# EAGLE design mapleCUx_large_226 (EAGLE 7.3.0)
MAPLE-CUx Large Version
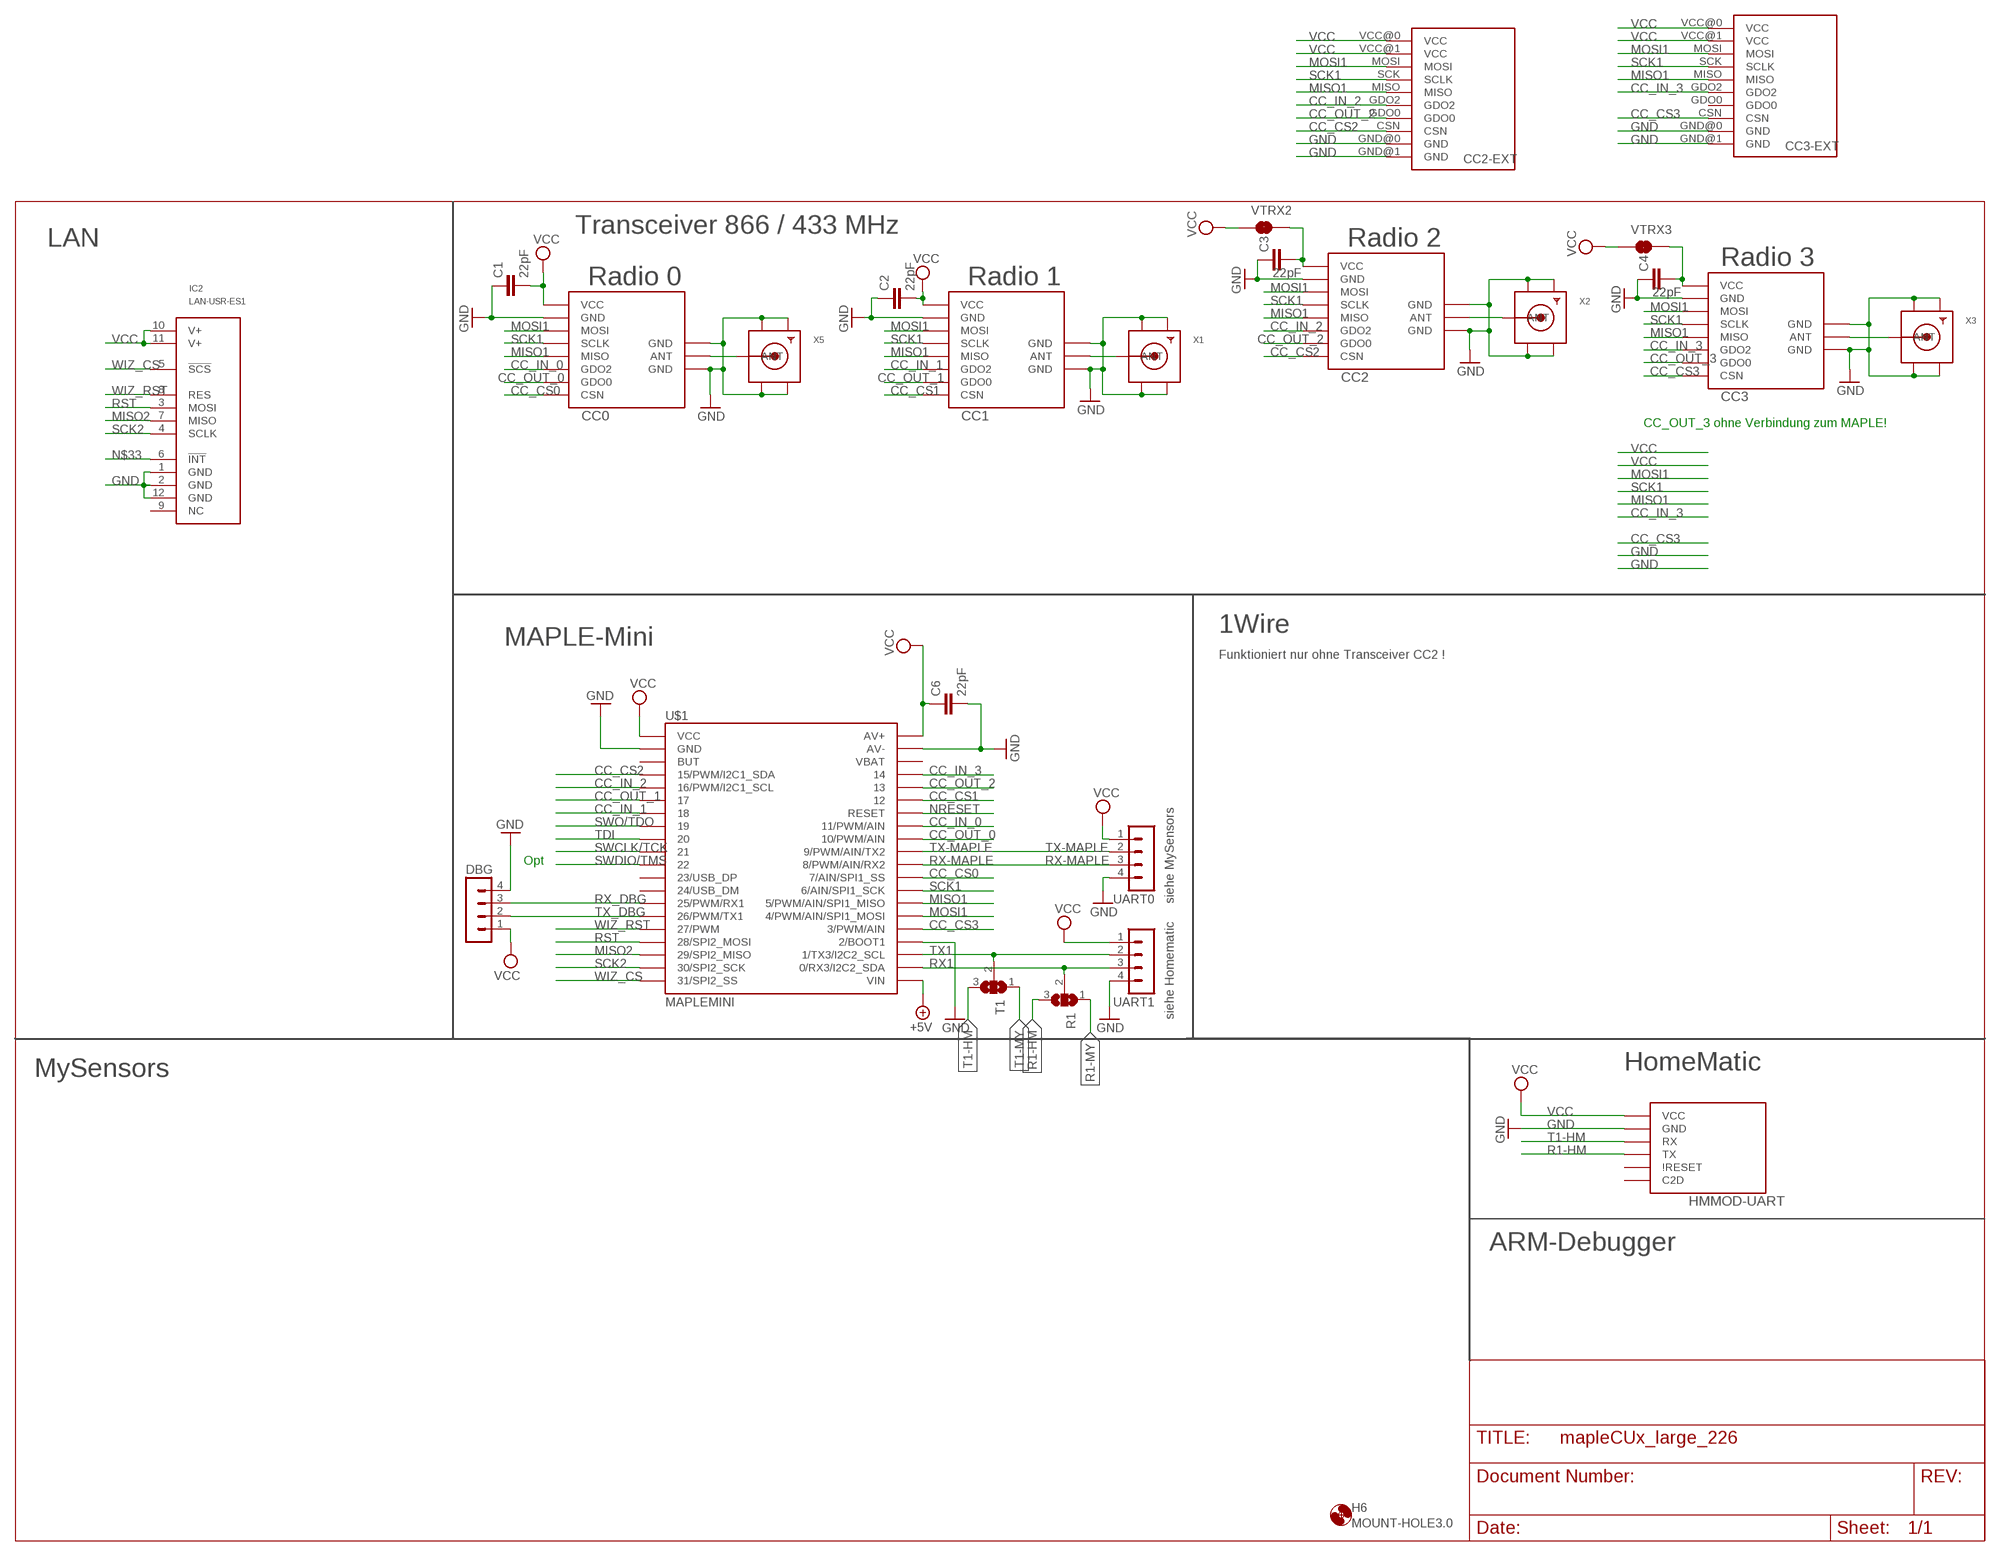
[diagram p0: schematic, sheet 1]

## Parts
C1  22pF  C-EUC0805  [C0805]
C2  22pF  C-EUC0805  [C0805]
C3  22pF  C-EUC0805  [C0805]
C4  22pF  C-EUC0805  [C0805]
C6  22pF  C-EUC0805  [C0805]
CC0  CC1101  CC1101_MODULE1SMD  [CC1101_MODULE1_SMD]
CC1  CC1101_MODULE1SMD  [CC1101_MODULE1_SMD]
CC2  CC1101_MODULE1SMD  [CC1101_MODULE1_SMD]
CC2-EXT  CC1101_MODULE3_DIL  [CC1101_MODULE3_DIL]
CC3  CC1101_MODULE1SMD  [CC1101_MODULE1_SMD]
CC3-EXT  CC1101_MODULE3_DIL  [CC1101_MODULE3_DIL]
DBG  MA04-1  [MA04-1]
H6  MOUNT-HOLE3.0  [3,0]
HMMOD-UART  HM-MOD-UARTDIL  [HM-MOD-UART-DIL]
IC2  LAN-USR-ES1  [USR-ES1]
R1  SJ2W  [SJ_2]
T1  SJ2W  [SJ_2]
U$1  MAPLEMINI  [20-DIP]
UART0  MA04-1  [MA04-1]
UART1  MA04-1  [MA04-1]
VTRX2  JUMPER-SMT_2_NC_TRACE_SILK  [SMT-JUMPER_2_NC_TRACE_SILK]
VTRX3  JUMPER-SMT_2_NC_TRACE_SILK  [SMT-JUMPER_2_NC_TRACE_SILK]
X1  SMACONNECTOR_EDGE  [SMA_EDGELAUNCH]
X2  SMACONNECTOR_EDGE  [SMA_EDGELAUNCH]
X3  SMACONNECTOR_EDGE  [SMA_EDGELAUNCH]
X5  SMACONNECTOR_EDGE  [SMA_EDGELAUNCH]

## Nets
+5V [PWR]: U$1.21(VIN)
ANT0: CC0.ANT X5.P(ANT)
ANT1: CC1.ANT X1.P(ANT)
ANT2: CC2.ANT X2.P(ANT)
ANT3: CC3.ANT X3.P(ANT)
CC_CS0: CC0.CSN U$1.29(7/AIN/SPI1_SS)
CC_CS1: CC1.CSN U$1.35
CC_CS2: CC2-EXT.CSN CC2.CSN U$1.4(15/PWM/I2C1_SDA)
CC_CS3: CC3-EXT.CSN CC3.CSN U$1.25(3/PWM/AIN)
CC_IN_0: CC0.GDO2 U$1.33(11/PWM/AIN)
CC_IN_1: CC1.GDO2 U$1.7
CC_IN_2: CC2-EXT.GDO2 CC2.GDO2 U$1.5(16/PWM/I2C1_SCL)
CC_IN_3: CC3-EXT.GDO2 CC3.GDO2 U$1.37
CC_OUT_0: CC0.GDO0 U$1.32(10/PWM/AIN)
CC_OUT_1: CC1.GDO0 U$1.6
CC_OUT_2: CC2-EXT.GDO0 CC2.GDO0 U$1.36
CC_OUT_3: CC3.GDO0
GND [PWR]: C1.1 C2.1 C3.1 C4.1 C6.2 CC0.GND@0(GND) CC0.GND@1(GND) CC0.GND@2(GND) CC1.GND@0(GND) CC1.GND@1(GND) CC1.GND@2(GND) CC2-EXT.GND@0(GND) CC2-EXT.GND@1(GND) CC2.GND@0(GND) CC2.GND@1(GND) CC2.GND@2(GND) CC3-EXT.GND@0(GND) CC3-EXT.GND@1(GND) CC3.GND@0(GND) CC3.GND@1(GND) CC3.GND@2(GND) DBG.4 HMMOD-UART.2(GND) IC2.1(GND) IC2.2(GND) IC2.12(GND) U$1.2(GND) U$1.24(2/BOOT1) U$1.39(AV-) UART0.4 UART1.4 X1.GND@1(GND4) X1.GND@2(GND3) X1.GND@3(GND2) X1.GND@4(GND1) X2.GND@1(GND4) X2.GND@2(GND3) X2.GND@3(GND2) X2.GND@4(GND1) X3.GND@1(GND4) X3.GND@2(GND3) X3.GND@3(GND2) X3.GND@4(GND1) X5.GND@1(GND4) X5.GND@2(GND3) X5.GND@3(GND2) X5.GND@4(GND1)
MISO1: CC0.MISO CC1.MISO CC2-EXT.MISO CC2.MISO CC3-EXT.MISO CC3.MISO U$1.27(5/PWM/AIN/SPI1_MISO)
MISO2: IC2.7(MISO) U$1.18(29/SPI2_MISO)
MOSI1: CC0.MOSI CC1.MOSI CC2-EXT.MOSI CC2.MOSI CC3-EXT.MOSI CC3.MOSI U$1.26(4/PWM/AIN/SPI1_MOSI)
N$1 [PWR]: C3.2 CC2.VCC VTRX2.2
N$3 [PWR]: C4.2 CC3.VCC VTRX3.2
N$33: IC2.6(!INT!)
NRESET: U$1.34(RESET)
R1-HM: HMMOD-UART.5(TX) R1.3
R1-MY: R1.1
RST: IC2.3(MOSI) U$1.17(28/SPI2_MOSI)
RX1: R1.2 U$1.22(0/RX3/I2C2_SDA) UART1.3
RX-MAPLE: U$1.30(8/PWM/AIN/RX2) UART0.3
RX_DBG: DBG.3 U$1.14(25/PWM/RX1)
SCK1: CC0.SCLK CC1.SCLK CC2-EXT.SCK(SCLK) CC2.SCLK CC3-EXT.SCK(SCLK) CC3.SCLK U$1.28(6/AIN/SPI1_SCK)
SCK2: IC2.4(SCLK) U$1.19(30/SPI2_SCK)
SWCLK/TCK: U$1.10
SWDIO/TMS: U$1.11
SWO/TDO: U$1.8
T1-HM: HMMOD-UART.6(RX) T1.3
T1-MY: T1.1
TDI: U$1.9
TX1: T1.2 U$1.23(1/TX3/I2C2_SCL) UART1.2
TX-MAPLE: U$1.31(9/PWM/AIN/TX2) UART0.2
TX_DBG: DBG.2 U$1.15(26/PWM/TX1)
VCC [PWR]: C1.2 C2.2 C6.1 CC0.VCC CC1.VCC CC2-EXT.VCC@0(VCC) CC2-EXT.VCC@1(VCC) CC3-EXT.VCC@0(VCC) CC3-EXT.VCC@1(VCC) DBG.1 HMMOD-UART.1(VCC) IC2.10(V+) IC2.11(V+) U$1.1(VCC) U$1.40(AV+) UART0.1 UART1.1 VTRX2.1 VTRX3.1
WIZ_CS: IC2.5(!SCS!) U$1.20(31/SPI2_SS)
WIZ_RST: IC2.8(RES) U$1.16(27/PWM)
Unconnected: CC3-EXT.GDO0 HMMOD-UART.3(C2D) HMMOD-UART.4(\!RESET) IC2.9(NC) U$1.3(BUT) U$1.12(23/USB_DP) U$1.13(24/USB_DM) U$1.38(VBAT)

## Notes on the sheet
- Transceiver 866 / 433 MHz
- LAN | Radio 2
- Radio 3
- Radio 0 | Radio 1
- CC_OUT_3 ohne Verbindung zum MAPLE!
- 1Wire
- MAPLE-Mini
- Funktioniert nur ohne Transceiver CC2 !
- Opt
- siehe MySensors
- siehe Homematic
- MySensors | HomeMatic
- ARM-Debugger

## Library data of the parts
C1-C4 C6 = rcl:C-EU: CAPACITOR, European symbol
CC0 CC1-CC3 = wireless:CC1101_MODULE1: CC1101 wireless module for 433/868 MHz (sold from Aliexpress). DIL version for mounting with pin header (and SMD soldering) and SMD only variant available.
CC2-EXT CC3-EXT = wireless:CC1101_MODULE3_DIL: 433 Mhz CC1101 wireless module named RF1101SE V3.1 package special has only limited silk screen on tPlace layer
DBG UART0 UART1 = con-lstb:MA04-1: PIN HEADER; OC_FARNELL: unknown; OC_NEWARK: unknown
H6 = holes:MOUNT-HOLE: MOUNTING HOLE with drill center marker
HMMOD-UART = wireless:HM-MOD-UART: eQ3 HM-MOD-UART-AW-SH2 wireless module for 868 MHz. DIL version for mounting with pin header (antenna upwards) and SMD variant available (antenna downwards).
IC2 = Martin-Communication:LAN-USR-ES1
R1 T1 = jumper:SJ2W: SMD solder JUMPER
U$1 = maplemini-small:MAPLEMINI
VTRX2 VTRX3 = SparkFun-Jumpers:JUMPER-SMT_2_NC_TRACE: Normally closed trace jumper This jumper has a trace between two pads so it's normally closed (NC). Use a razor knife to open the connection. For best results follow the IPC guidelines for cutting traces: Cutout at least 0.063 mm (0.005 in). Remove all loose material to clean up the cut area. Seal the cut with an approved epoxy. Reapply solder to reclose the connection.
X1-X3 X5 = adafruit:SMACONNECTOR: SMA Connector 90° DIP SMA Connector, 50 Ohm (4UConnector: 07259)

## Net classes
0 default: width 0.305 mm
1 PWR: width 0.457 mm

## Board
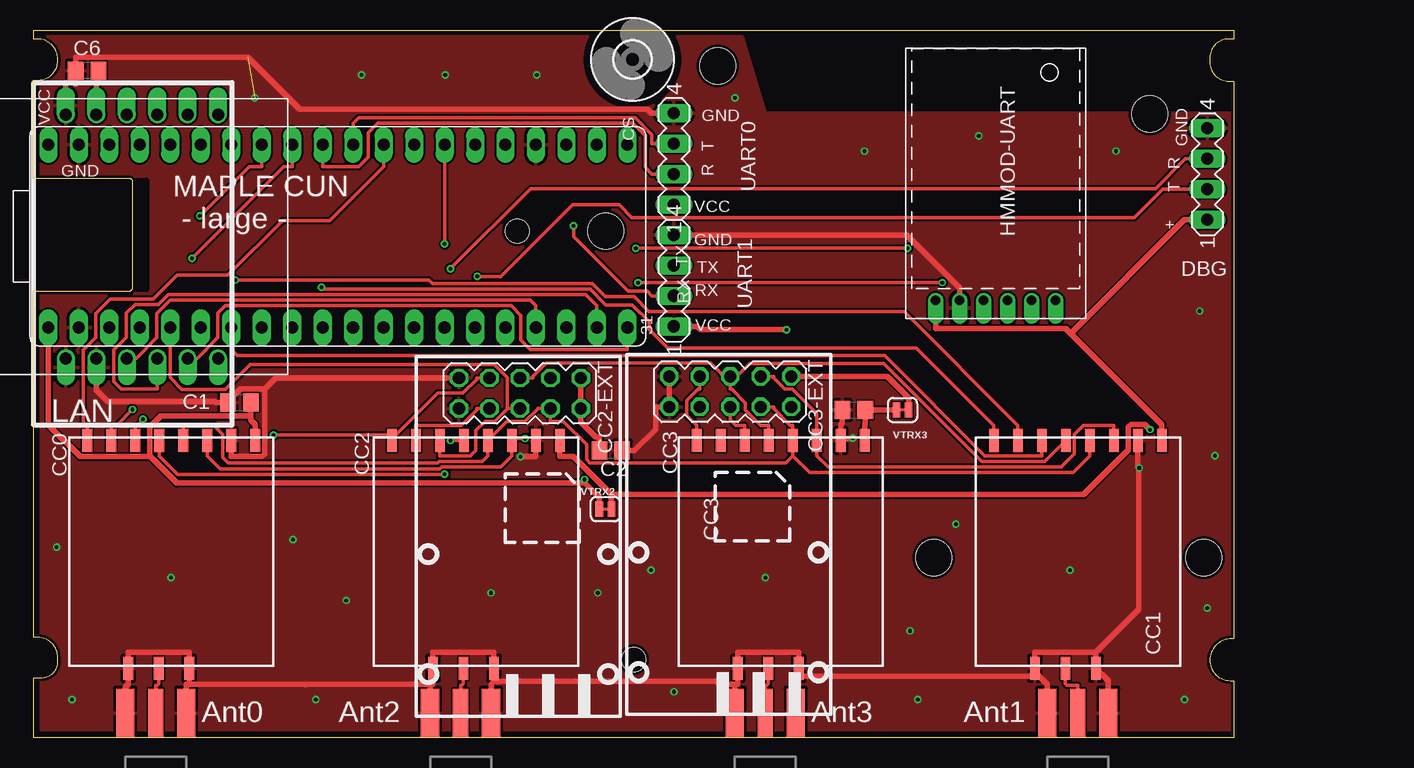
[diagram p1: board, top side]
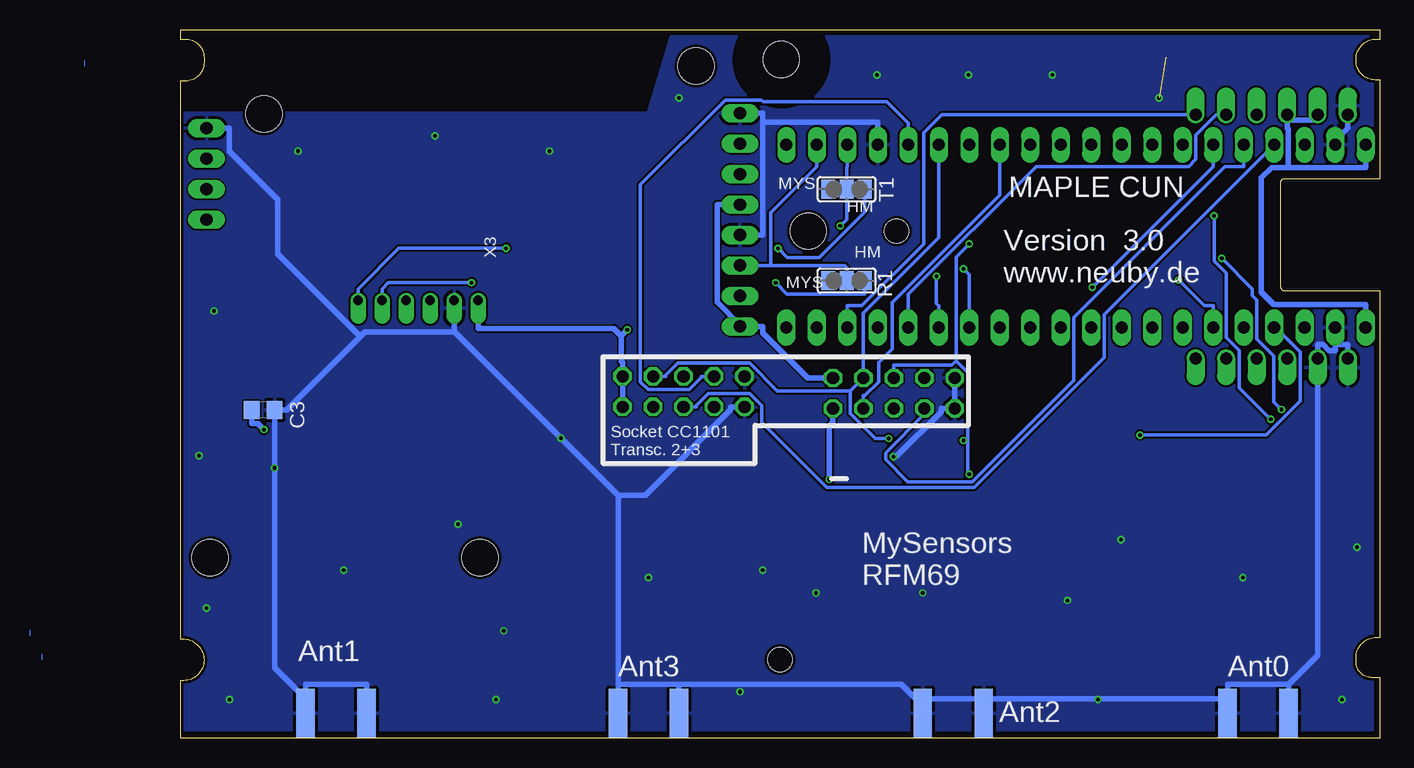
[diagram p2: board, bottom side, seen from below]

Size 100 x 59 mm. Coordinates in mm from the lower left corner, seen from the top.
Outline: 100,59 100,58.24 99.54,58.24 arc90 98,56.7 98,56.41 arc90 99.41,54.75 100,54.75 100,8.24 99.8,8.24 arc90 98,6.44 arc90 99.69,4.75 100,4.75 100,0 0,0 0,5 0.71,5 arc90 2,6.29 2,6.67 arc90 0.32,8.35 0,8.35 0,37.21 7.89,37.21 arc90 8.26,37.58 8.26,46.32 arc90 7.97,46.61 0,46.61 0,54.83 0.39,54.83 arc90 2,56.44 2,56.57 arc90 0.33,58.24 0,58.24 0,59 51,59
Outline: 51,59 100,59
Outline: 51,59 100,59
Copper layers (1*16): Top 0.035mm / dielectric 1.5mm / Bottom 0.035mm
Design rules "SeeedStudio_2layer_DRU_no_angle_20140221": minimum track width 6mil, minimum drill 12mil, track to track 6mil, track to pad 6mil, pad to pad 6mil, via to via 6mil, smd to smd 0mil, copper to edge 10mil, drill to drill 10mil, minimum pad ring 10mil, minimum via ring 6mil, stop-mask expansion 2mil, vias tented up to drill 100mil, thermal gap 10mil
Holes 2 mm at 50,6.5 40.28,42.23
Holes 3 mm at 47.65,42.23 93,52 57,56 75,15 97.5,15
tRestrict: area 0,37.3 to 9.4,46.5
bRestrict: area 0,37.3 to 9.4,46.5

### Footprints (pad centres in the part's own frame; a part is rotated, then mirrored left to right if it is on the bottom)
C0805 = smd 1.3 x 1.5: 1 -0.95,0; 2 0.95,0
CC1101_MODULE1_SMD = smd 1.93 x 0.813: ANT 19,5.96; CSN 0,0; GDO0 0,2; GDO2 0,4; GND@0 0,12; GND@1 19,8.5; GND@2 19,3.42; MISO 0,6; MOSI 0,10; SCLK 0,8; VCC 0,14
CC1101_MODULE3_DIL = drill 1.016 octagon: CSN 1.81,6.1; GDO0 4.35,6.1; GDO2 4.35,8.64; GND@0 1.81,3.56; GND@1 4.35,3.56; MISO 1.81,8.64; MOSI 1.81,11.18; SCK 4.35,11.18; VCC@0 1.81,13.72; VCC@1 4.35,13.72
MA04-1 = drill 1.016 long: 1 -3.81,0; 2 -1.27,0; 3 1.27,0; 4 3.81,0
3,0 = hole 3: 0,0
HM-MOD-UART-DIL = drill 0.8 offset: 1 0,12; 2 0,10; 3 0,8; 4 0,6; 5 0,4; 6 0,2
USR-ES1 = drill 1 pad 1.35 offset: 1 -10.16,5.715; 2 -10.16,3.175; 3 -10.16,0.635; 4 -10.16,-1.905; 5 -10.16,-4.445; 6 -10.16,-6.985; 7 10.16,-6.985; 8 10.16,-4.445; 9 10.16,-1.905; 10 10.16,0.635; 11 10.16,3.175; 12 10.16,5.715
SJ_2 = smd 1.168 x 1.6: 1 -1.524,0; 2 0,0; 3 1.524,0
20-DIP = drill 1.016 pad 1.27 long: 1 -24.13,-7.62; 2 -21.59,-7.62; 3 -19.05,-7.62; 4 -16.51,-7.62; 5 -13.97,-7.62; 6 -11.43,-7.62; 7 -8.89,-7.62; 8 -6.35,-7.62; 9 -3.81,-7.62; 10 -1.27,-7.62; 11 1.27,-7.62; 12 3.81,-7.62; 13 6.35,-7.62; 14 8.89,-7.62; 15 11.43,-7.62; 16 13.97,-7.62; 17 16.51,-7.62; 18 19.05,-7.62; 19 21.59,-7.62; 20 24.13,-7.62 | drill 1 pad 1.27 long: 21 24.13,7.62; 22 21.59,7.62; 23 19.05,7.62; 24 16.51,7.62; 25 13.97,7.62; 26 11.43,7.62; 27 8.89,7.62; 28 6.35,7.62; 29 3.81,7.62; 30 1.27,7.62; 31 -1.27,7.62; 32 -3.81,7.62; 33 -6.35,7.62; 34 -8.89,7.62; 35 -11.43,7.62; 36 -13.97,7.62; 37 -16.51,7.62; 38 -19.05,7.62; 39 -21.59,7.62; 40 -24.13,7.62
SMT-JUMPER_2_NC_TRACE_SILK = smd 0.635 x 1.27: 1 -0.508,0; 2 0.508,0
SMA_EDGELAUNCH = smd 4.064 x 1.524: GND@1 2.032,-2.54; GND@2 2.032,2.54 | smd 4.064 x 1.524 bottom: GND@3 2.032,2.54; GND@4 2.032,-2.54 | smd 4.064 x 1.27: P 2.032,0

### Placement (x,y rotation side)
C1  17.14,27.94 0 top
C2  48.08,23.95 180 top
C3  93.08,27.3 180 bottom
C4  68.33,27.3 0 top
C6  4.45,55.61 180 top
CC0  4.45,24.77 270 top
CC1  80.01,24.77 270 top
CC2  29.84,24.77 270 top
CC2-EXT  31.87,31.79 270 top
CC3  55.24,24.77 270 top
CC3-EXT  49.4,31.93 270 top
DBG  97.79,46.99 90 top
H6  49.89,56.55 0 top
HMMOD-UART  87.15,36.45 90 top
IC2  8.38,41.78 90 top
R1  44.45,38.1 0 bottom
T1  44.45,45.72 0 bottom
U$1  25.34,41.8 0 top
UART0  53.34,48.26 90 top
UART1  53.34,38.1 90 top
VTRX2  47.62,19.05 0 top
VTRX3  72.39,27.3 180 top
X1  87,0 90 top
X2  35.56,0 90 top
X3  60.96,0 90 top
X5  10.16,0 90 top

### Tracks (layer width: path | path; a pad name or v marks a point on that pad's centre or on a via)
ANT0
  Top 0.305: X5.P 10.16,4.37 10.28,4.37 10.4,4.5 CC0.ANT
ANT1
  Top 0.305: X1.P 87,4.37 86.1,4.37 85.97,4.5 CC1.ANT
ANT2
  Top 0.305: X2.P 35.56,4.37 35.68,4.37 35.8,4.5 CC2.ANT
ANT3
  Top 0.305: X3.P 60.96,4.37 61.08,4.37 61.2,4.5 CC3.ANT
CC_CS0
  Top 0.305: CC0.CSN 4.45,26.04 4.14,26.34 4.14,32.3 5.18,33.34 5.18,35.36 6.38,36.56 9.96,36.56 11.94,38.54 16.18,38.54 20.75,43.11 24.65,43.11 29.15,47.61 U$1.29
CC_CS1  (via drill 0.3 pad 0.61)
  Top 0.305: v23.98,37.53 24.13,37.38 46.36,37.38 47.67,36.07 49.88,36.07 51.27,34.69 51.27,34.03 52.81,32.49 73.56,32.49 80.01,26.04 CC1.CSN
  Bottom 0.305: v23.98,37.53 13.91,47.61 U$1.35
CC_CS2  (via drill 0.3 pad 0.61)
  Top 0.305: 29.84,24.91 29.54,25.21 v19.99,25.21 | CC2-EXT.CSN 36.9,29.98 36.9,29.87 35.74,28.71 33.64,28.71 29.84,24.91 | CC2.CSN 29.84,24.91
  Bottom 0.305: U$1.4 8.69,34.18 6.66,32.14 6.66,28.05 9.49,25.21 v19.99,25.21
CC_CS3
  Top 0.305: CC3.CSN 55.24,26.04 54.42,26.86 54.42,28.1 55.36,29.05 55.49,29.05 CC3-EXT.CSN
  Bottom 0.305: CC3-EXT.CSN 56.56,30.11 56.56,30 57.55,29.02 61,29.02 61.64,29.66 61.64,46.09 54.56,53.17 51.55,53.17 51.4,53.01 41.09,53.01 39.31,51.23 U$1.25
CC_IN_0  (via drill 0.3 pad 0.61)
  Top 0.305: v9.11,26.53 8.61,26.04 8.45,26.04 CC0.GDO2 | v13.83,43.49 17.95,47.61 18.99,47.61 U$1.33
  Bottom 0.305: v13.83,43.49 13.83,39.74 12.8,38.71 12.8,33.34 11.72,32.26 11.72,29.15 v9.11,26.53
CC_IN_1
  Top 0.305: U$1.7 16.45,32.35 16.94,31.86 70.89,31.86 79.26,23.5 84.01,23.5 CC1.GDO2
CC_IN_2
  Top 0.305: CC2.GDO2 33.84,23.5 36.38,23.5 36.84,23.96 36.84,25.6 37.62,26.37 38.41,26.37 39.48,27.44 | U$1.5 11.37,30.01 12.34,29.04 15.97,29.04 18.03,31.1 38.36,31.1 39.44,30.02 39.44,27.48 39.48,27.44 | 39.48,27.44 39.56,27.44 CC2-EXT.GDO2
CC_IN_3
  Top 0.305: CC3.GDO2 59.24,26.04 58.51,26.04 58.03,26.51 CC3-EXT.GDO2
  Bottom 0.305: CC3-EXT.GDO2 56.97,27.57 56.97,27.69 55.98,28.67 52.5,28.67 51.54,27.7 51.54,26.25 46.12,20.83 33.82,20.83 22.97,31.69 22.97,35.28 U$1.37
CC_OUT_0  (via drill 0.3 pad 0.61)
  Top 0.305: v13.19,39.96 20.83,47.61 21.53,47.61 U$1.32 | CC0.GDO0 6.45,26.04 6.89,26.04 v8.21,27.35
  Bottom 0.305: v8.21,27.35 8.86,28 8.86,31.81 10.26,33.22 10.26,36.49 10.63,36.86 10.63,37.4 v13.19,39.96
CC_OUT_1  (via drill 0.3 pad 0.61)
  Top 0.305: v16.79,38.14 32.93,38.14 33.24,37.84 46.55,37.84 47.63,36.76 50.03,36.76 51.26,35.53 72.52,35.53 82.01,26.04 CC1.GDO0
  Bottom 0.305: v16.79,38.14 14.65,36.01 13.91,36.01 U$1.6
CC_OUT_2
  Top 0.305: CC2.GDO0 31.84,26.04 35.63,26.04 36.9,27.31 36.9,27.44 CC2-EXT.GDO0
  Bottom 0.305: CC2-EXT.GDO0 37.97,26.96 41.2,23.73 41.2,23.19 39.34,21.33 33.99,21.33 25.53,29.79 25.53,35.02 12.94,47.61 11.37,47.61 U$1.36
GND  (via drill 0.3 pad 0.61)  (1 unrouted)
  Top 0.457: 88.51,7.11 83.43,7.11 CC1.GND@2 83.43,5.47 | 63.74,5.09 83.05,5.09 83.43,5.47 | 88.51,7.11 CC1.GND@1 89.53,4.74 X1.GND@4 | 92.1,22.48 92.1,10.7 88.51,7.11 | 92.1,22.48 92.01,22.57 92.01,23.42 CC1.GND@0 | v92.12,22.48 92.1,22.48 | 67.25,24.95 CC3.GND@0 | 67.25,24.95 67.25,25.44 67.25,26.11 67.31,26.17 67.38,26.17 C4.1 | v68.25,24.95 67.25,24.95 | 19.25,29.07 17.22,29.07 16.2,28.05 C1.1 15.16,27.94 15.06,28.04 6.15,28.04 5.21,28.98 IC2.2 | 19.25,29.07 20.16,29.98 CC2-EXT.GND@0 | 19.25,29.07 19.25,23.66 19.01,23.42 16.45,23.42 CC0.GND@0 | v40.55,23.42 41.84,23.42 CC2.GND@0 | UART0.4 51.44,52.07 51.1,52.4 22.17,52.4 17.84,56.74 3.5,56.74 C6.2 3.5,55.2 3.5,54.48 3.39,54.59 2.67,54.59 IC2.12 | 12.95,4.45 22.61,4.45 22.67,4.38 22.74,4.45 33.02,4.45 33.02,4.42 | 12.95,4.45 12.7,4.45 X5.GND@4 | 12.95,4.45 CC0.GND@1 12.95,7.11 7.87,7.11 CC0.GND@2 7.87,5.09 7.87,4.42 7.62,4.17 X5.GND@3 | HMMOD-UART.2 77.15,37.48 72.73,41.91 UART1.4 | X2.GND@3 33.02,4.42 | 33.02,4.42 33.27,4.42 CC2.GND@2 33.27,7.11 38.34,7.11 CC2.GND@1 38.34,4.69 | 38.34,4.69 56.83,4.69 57.1,4.42 58.42,4.42 | X3.GND@3 58.42,4.42 | 58.42,4.42 58.66,4.42 CC3.GND@2 58.66,7.11 63.74,7.11 CC3.GND@1 63.74,5.09 | 38.34,4.69 38.1,4.45 X2.GND@1 | 83.43,5.47 84.45,4.45 X1.GND@3 | 63.74,5.09 63.74,4.42 63.5,4.17 X3.GND@4 | C2.1 50.06,23.95 51.81,25.7 51.81,27.57 CC3-EXT.GND@1 CC3-EXT.GND@0
  Bottom 0.457: CC3-EXT.GND@1 54.1,27.57 54.1,27.34 61.23,20.21 63.5,20.21 | 63.5,20.21 v68.25,24.95 77.1,33.81 77.15,33.81 | 63.5,4.45 63.5,20.21 | 63.5,4.45 58.42,4.45 | 84.97,33.43 91.09,27.3 C3.1 v92.12,22.48 92.12,5.83 89.53,3.24 | 77.15,33.81 84.59,33.81 84.97,33.43 | 84.97,33.43 91.86,40.32 91.86,44.87 95.89,48.9 95.89,50.8 DBG.4 | 77.15,33.81 77.15,34.72 HMMOD-UART.2 | 51.44,51.31 51.44,52.07 UART0.4 | 51.44,51.31 51.44,41.91 UART1.4 | 51.44,51.31 41.85,51.31 U$1.24 | 7.62,4.45 12.7,4.45 12.7,3.24 | 7.62,4.45 7.62,3.24 X5.GND@3 | 7.62,4.45 5.21,6.86 IC2.2 5.21,32.76 4.74,32.76 4.25,32.27 3.75,32.27 3.75,33.08 | v40.55,23.42 40.32,23.42 36.57,27.16 36.57,27.44 CC2-EXT.GND@1 CC2-EXT.GND@0 | IC2.1 2.67,32.76 3.43,32.76 3.75,33.08 | 3.75,33.08 3.75,33.88 3.75,34.02 U$1.2 | 38.1,2.63 39.91,4.45 58.42,4.45 | 38.1,2.63 38.1,3.24 33.02,3.24 | X2.GND@1 38.1,2.63 | X5.GND@4 12.7,3.24 | 12.7,3.24 33.02,3.24 | X3.GND@3 58.42,4.45 | X3.GND@4 63.5,4.45 | X2.GND@3 33.02,3.24 | IC2.12 2.67,50.81 3.75,49.73 U$1.39 | 89.53,3.24 89.53,4.45 84.45,4.45 X1.GND@3 | X1.GND@4 89.53,3.24
  other vias: 18.41,53.34 27.3,55.24 34.29,55.24 41.91,55.24 58.42,53.34 69.22,48.9 78.74,50.16 90.17,48.9 97.16,35.56 98.42,23.5 97.79,10.79 95.89,3.17 73.66,3.17 53.34,3.81 23.5,3.17 3.17,3.17 1.91,15.88 21.59,16.51 26.04,11.43 46.99,12.06 51.44,13.97 73.03,8.89 76.83,17.78 86.36,13.97 60.96,13.34 38.1,12.06 11.43,13.34
  pour Bottom: 0.64,0.64 0.64,58.42 59.05,58.42 60.96,52.07 99.69,52.07 99.69,0.64
  pour Top: 0.64,0.64 0.64,58.42 59.05,58.42 60.96,52.07 99.69,52.07 99.69,0.64
MISO1  (via drill 0.3 pad 0.61)
  Top 0.305: U$1.27 v34.23,41.16 | CC2.MISO v34.72,24.77 | CC0.MISO 10.45,23.5 11.99,21.95 v34.23,21.95 | 58.03,29.58 59.65,31.2 70.82,31.2 79.01,23.01 84.25,23.01 CC1.MISO | 58.03,29.58 56.39,31.23 42.71,31.23 41.58,30.09 41.58,29.98 CC2-EXT.MISO | 58.03,29.58 58.03,29.05 58.15,29.05 59.3,27.89 59.3,27.3 60.57,26.04 61.24,26.04 CC3.MISO | CC3-EXT.MISO 58.03,29.58
  Bottom 0.305: 35.33,31.39 35.33,40.06 v34.23,41.16 | 34.36,24.77 v34.72,24.77 | v34.23,21.95 34.36,22.07 34.36,24.77 | 35.33,31.39 34.36,30.42 34.36,24.77 | 35.33,31.39 35.68,31.05 40.51,31.05 CC2-EXT.MISO
MISO2
  Bottom 0.305: U$1.18 44.39,36.01 43.18,36.01 38.04,41.16 38.04,50.44 36.53,51.94 IC2.7
MOSI1  (via drill 0.3 pad 0.61)
  Top 0.305: v40.93,24.94 40.02,24.94 CC2.MOSI 39.84,23.5 38.91,22.56 33.98,22.56 33.84,22.41 15.53,22.41 14.45,23.5 CC0.MOSI | CC1.MOSI 90.01,26.04 87.47,26.04 86.72,25.29 86.72,23.64 85.63,22.55 66.19,22.55 65.25,23.5 CC3.MOSI 65.25,27.02 63.22,29.05 62.58,29.05 61.64,29.98 61.64,30.11 CC3-EXT.MOSI
  Bottom 0.305: CC3-EXT.MOSI 59.51,30.11 59.51,30.23 58.52,31.21 52.53,31.21 50.22,28.89 44.14,28.89 | 44.14,28.89 CC2-EXT.MOSI 43.05,35.41 36.77,41.7 U$1.26 | v40.93,24.94 42.07,24.94 44.14,27.01 44.14,28.89
N$1  (via drill 0.3 pad 0.61)
  Top 0.457: 48.13,20.25 44.97,23.42 43.84,23.42 CC2.VCC | 48.13,20.25 48.13,20.07 VTRX2.2 | 48.13,20.25 87.48,20.25 91.22,24 91.22,25.89 91.45,26.11 92.58,26.11 v93.01,25.68
  Bottom 0.457: C3.2 94.03,26.17 93.5,26.17 v93.01,25.68
N$2
  Bottom 0: 112.5,8.5 112.5,9
N$3
  Top 0.457: VTRX3.2 C4.2 69.28,26.15 69.25,26.11 CC3.VCC
N$4
  Bottom 0: 111.5,6.5 111.5,7
N$5
  Bottom 0: 108,56.5 108,56
R1-HM  (via drill 0.3 pad 0.61)
  Top 0.305: v50.35,37.93 v75.7,37.93
  Bottom 0.305: R1.3 42.93,36.99 49.42,36.99 v50.35,37.93 | v75.7,37.93 82.63,37.93 83.15,37.41 HMMOD-UART.5
RST
  Top 0.305: IC2.3 8.54,31.62 10.26,33.34 10.26,35.34 11.38,36.47 41.39,36.47 41.85,36.01 U$1.17
RX1
  Bottom 0.305: 50.77,39.37 44.62,39.37 44.45,39.2 R1.2 | UART1.3 50.77,39.37 | 50.77,39.37 50.77,43.76 46.93,47.61 U$1.22
RX-MAPLE
  Top 0.305: U$1.30 26.61,51.23 27.06,51.69 50.1,51.69 51.51,50.28 51.51,49.53 UART0.3
RX_DBG  (via drill 0.3 pad 0.61)
  Top 0.305: v34.71,39.09 41.4,45.78 93.48,45.78 95.96,48.26 DBG.3
  Bottom 0.305: v34.71,39.09 34.23,38.6 34.23,36.01 U$1.14
SCK1
  Top 0.305: 63.24,23.5 64.65,22.09 86.61,22.09 88.01,23.5 CC1.SCLK | CC0.SCLK 12.45,26.04 14.99,26.04 15.73,25.29 15.73,23.34 16.19,22.88 33.66,22.88 33.79,23.01 37.36,23.01 37.84,23.5 CC2.SCLK 39.43,26.35 40.93,26.35 41.98,27.4 41.98,27.44 CC2-EXT.SCK 43.05,26.37 44.12,26.37 46.06,24.43 46.06,23.17 46.34,22.89 62.64,22.89 63.24,23.5 | CC3-EXT.SCK 61.64,27.57 61.64,27.44 63.05,26.04 63.24,26.04 CC3.SCLK 63.24,23.5
  Bottom 0.305: CC2-EXT.SCK 43.05,28.51 42.94,28.51 41.78,29.67 41.78,31.27 40.65,32.4 40.65,36.26 31.69,45.23 U$1.28
SCK2
  Top 0.305: IC2.4 10.29,29.06 7.29,29.06 6.67,29.67 6.67,32.29 7.72,33.34 7.72,35.39 8.44,36.11 10.37,36.11 11.19,36.92 46.01,36.92 46.93,36.01 U$1.19
T1-HM  (via drill 0.3 pad 0.61)
  Top 0.305: v50.16,40.8 v72.82,40.8
  Bottom 0.305: v50.16,40.8 49.38,40.02 46.72,40.02 42.93,43.82 42.93,44.62 T1.3 | v72.82,40.8 81.76,40.8 85.15,37.41 HMMOD-UART.6
TX1  (via drill 0.3 pad 0.61)
  Top 0.305: v44.98,42.68 44.98,41.79 49.56,37.21 51.13,37.21 51.51,36.83 UART1.2
  Bottom 0.305: v44.98,42.68 44.45,43.21 T1.2 44.45,47.54 44.39,47.61 U$1.23
TX-MAPLE
  Top 0.305: U$1.31 24.07,47.61 27.1,47.61 27.88,48.38 27.88,50.43 28.68,51.23 49.91,51.23 50.95,50.19 50.95,47.55 51.51,46.99 UART0.2
TX_DBG  (via drill 0.3 pad 0.61)
  Top 0.305: DBG.2 94.07,45.72 91.71,43.37 49.83,43.37 48.78,44.42 44.89,44.42 38.92,38.45 v36.96,38.45
  Bottom 0.305: v36.96,38.45 36.96,36.2 36.77,36.01 U$1.15
VCC  (via drill 0.3 pad 0.61)
  Top 0.457: 86.41,33.71 94.01,26.11 CC1.VCC | 86.41,33.71 86.02,34.11 75.15,34.11 HMMOD-UART.1 | 86.41,33.71 95.89,43.18 DBG.1 | 9.66,23.48 9.66,25.89 10.57,26.81 18.09,26.81 | 45.9,21.21 11.93,21.21 9.66,23.48 | U$1.1 1.21,26.08 3.87,23.42 9.59,23.42 9.66,23.48 | VTRX2.1 47.12,20.07 47.05,20.07 45.9,21.21 | v45.9,21.52 45.9,21.21 | IC2.11 5.21,54.59 5.39,54.77 C6.1 | UART1.1 55.24,34.29 55.53,34.01 v62.73,34.01 | C2.2 47.12,25.08 46.81,25.08 45.59,26.3 CC2-EXT.VCC@1 CC2-EXT.VCC@0 | VTRX3.1 72.9,28.32 71.1,30.11 CC3-EXT.VCC@0 | CC0.VCC 18.45,26.11 18.09,26.46 18.09,26.81 | C1.2 18.09,26.81
  Bottom 0.457: 7.65,47.53 9.04,47.53 9.9,46.67 9.9,37.14 8.84,36.08 1.21,36.08 U$1.1 | 7.65,47.53 7.65,50.71 7.75,50.81 7.75,51.47 | 7.65,47.53 1.21,47.53 U$1.40 | CC2-EXT.VCC@1 45.59,26.3 45.9,25.98 v45.9,21.52 | 63.24,33.5 v62.73,34.01 | 63.24,33.5 63.84,34.11 75.15,34.11 HMMOD-UART.1 | 63.24,33.5 63.24,31.38 63.12,31.26 CC3-EXT.VCC@0 CC3-EXT.VCC@1 | 7.75,51.47 5.68,51.47 IC2.11 | IC2.10 7.75,51.47 | UART0.1 55.24,44.45 55.24,36.31 53.23,34.29 | 53.23,34.29 51.44,34.29 51.44,33.72 47.69,29.98 CC2-EXT.VCC@0 | UART1.1 53.23,34.29
WIZ_CS
  Top 0.305: U$1.20 49.47,32.35 41.37,32.35 40.58,33.15 40.58,35.2 39.77,36.01 15.96,36.01 15.34,35.39 15.34,33.34 13.62,31.62 IC2.5
WIZ_RST
  Bottom 0.305: IC2.8 13.64,51.94 15.34,50.24 15.34,48.23 15.96,47.61 28.66,47.61 39.31,36.96 39.31,36.01 U$1.16

### Text on the board
tNames: CS | VCC | GND | T | GND | GND | R | R | VCC | T | + | MAPLE CUN / - large - | GND | TX | TX | RX | RX | 31 | VCC | LAN | CC3 | Ant0 | Ant2 | Ant3 | Ant1
bNames: MYS | MAPLE CUN | HM | HM | Version 3.0 / www.neuby.de | MYS | Socket CC1101 / Transc. 2+3 | MySensors / RFM69 | Ant1 | Ant0 | Ant3 | Ant2